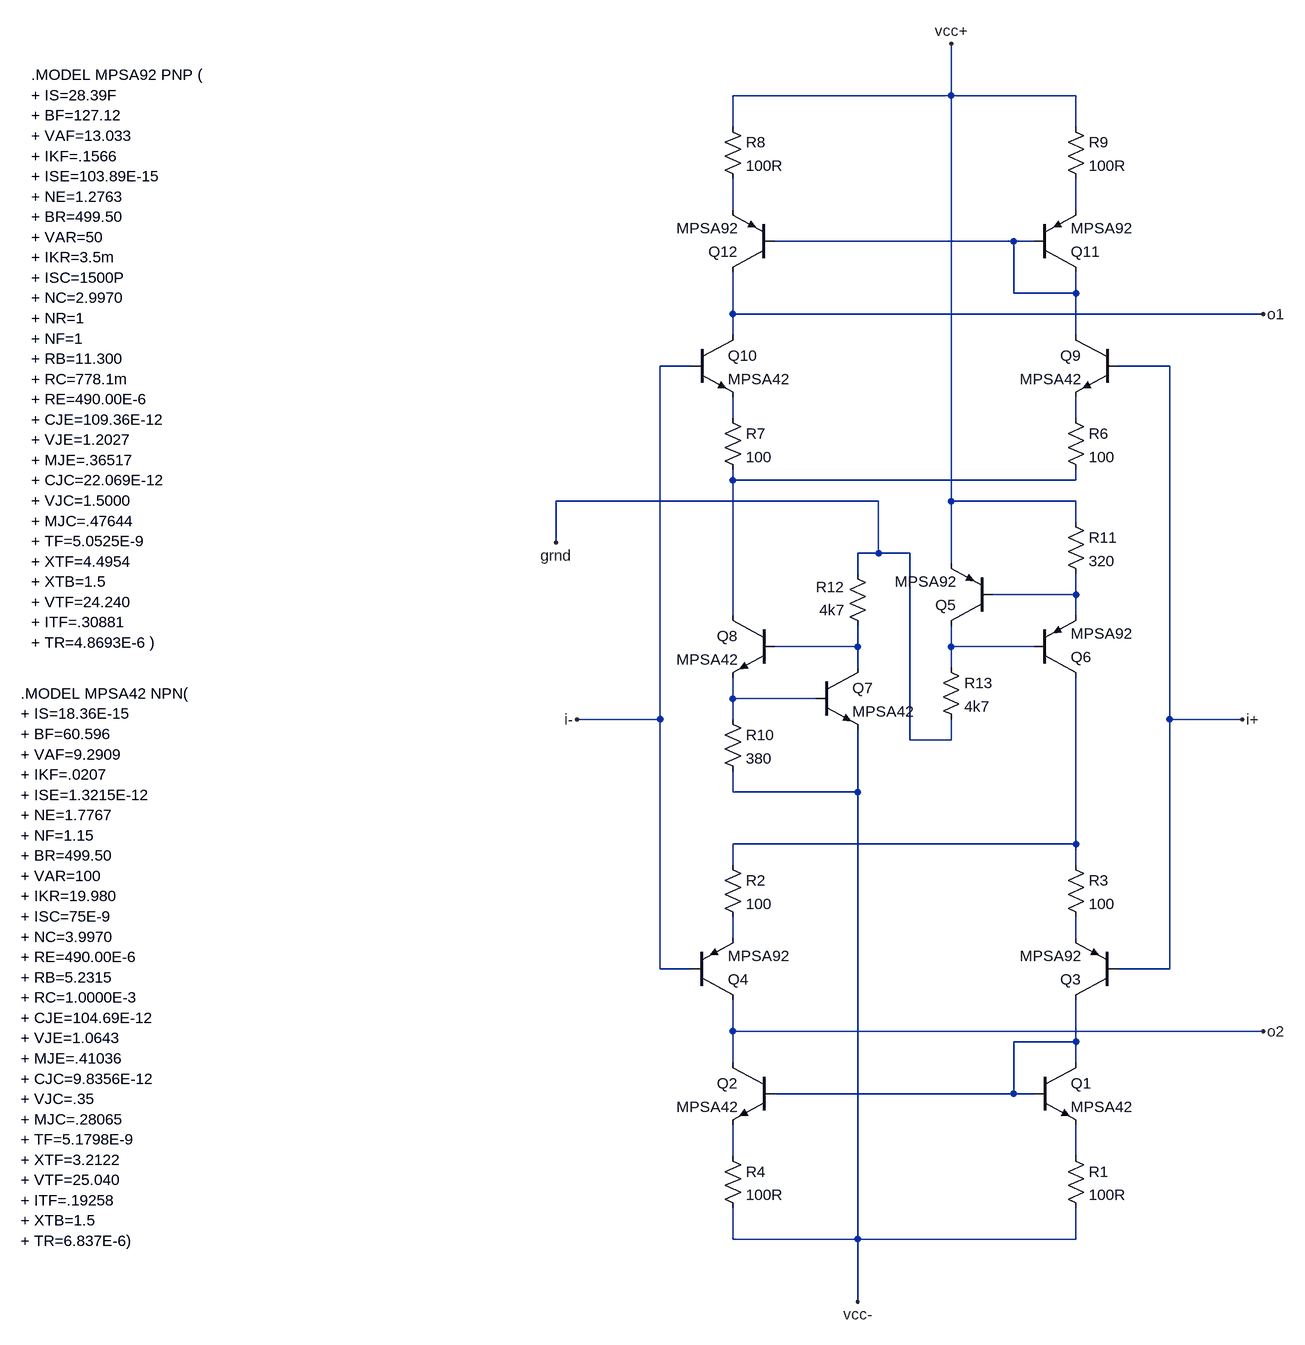
[diagram p0: schematic doble-par.asc]
doble-par.asc, the LTspice schematic file:
Version 4
SHEET 1 1184 756
WIRE 656 -1200 656 -1280
WIRE 656 -1200 320 -1200
WIRE 848 -1200 656 -1200
WIRE 320 -1152 320 -1200
WIRE 848 -1152 848 -1200
WIRE 320 -1024 320 -1072
WIRE 848 -1024 848 -1072
WIRE 752 -976 384 -976
WIRE 784 -976 752 -976
WIRE 752 -896 752 -976
WIRE 848 -896 848 -928
WIRE 848 -896 752 -896
WIRE 320 -864 320 -928
WIRE 1136 -864 320 -864
WIRE 320 -832 320 -864
WIRE 848 -832 848 -896
WIRE 256 -784 208 -784
WIRE 992 -784 912 -784
WIRE 320 -704 320 -736
WIRE 848 -704 848 -736
WIRE 320 -608 320 -624
WIRE 848 -608 848 -624
WIRE 848 -608 320 -608
WIRE 544 -576 48 -576
WIRE 656 -576 656 -1200
WIRE 848 -576 656 -576
WIRE 848 -544 848 -576
WIRE 48 -512 48 -576
WIRE 544 -496 544 -576
WIRE 544 -496 512 -496
WIRE 592 -496 544 -496
WIRE 656 -480 656 -576
WIRE 512 -464 512 -496
WIRE 848 -432 848 -464
WIRE 848 -432 720 -432
WIRE 320 -400 320 -608
WIRE 848 -400 848 -432
WIRE 512 -352 512 -384
WIRE 512 -352 384 -352
WIRE 656 -352 656 -384
WIRE 784 -352 656 -352
WIRE 512 -320 512 -352
WIRE 656 -320 656 -352
WIRE 320 -272 320 -304
WIRE 448 -272 320 -272
WIRE 208 -240 208 -784
WIRE 208 -240 80 -240
WIRE 320 -240 320 -272
WIRE 992 -240 992 -784
WIRE 1104 -240 992 -240
WIRE 592 -208 592 -496
WIRE 656 -208 656 -240
WIRE 656 -208 592 -208
WIRE 320 -128 320 -160
WIRE 512 -128 512 -224
WIRE 512 -128 320 -128
WIRE 848 -48 848 -304
WIRE 848 -48 320 -48
WIRE 320 -16 320 -48
WIRE 848 -16 848 -48
WIRE 320 96 320 64
WIRE 848 96 848 64
WIRE 208 144 208 -240
WIRE 256 144 208 144
WIRE 992 144 992 -240
WIRE 992 144 912 144
WIRE 320 240 320 192
WIRE 1136 240 320 240
WIRE 848 256 848 192
WIRE 848 256 752 256
WIRE 320 288 320 240
WIRE 848 288 848 256
WIRE 752 336 752 256
WIRE 752 336 384 336
WIRE 784 336 752 336
WIRE 320 432 320 384
WIRE 848 432 848 384
WIRE 320 560 320 512
WIRE 512 560 512 -128
WIRE 512 560 320 560
WIRE 848 560 848 512
WIRE 848 560 512 560
WIRE 512 656 512 560
FLAG 80 -240 i-
FLAG 1104 -240 i+
FLAG 1136 -864 o1
FLAG 656 -1280 vcc+
FLAG 512 656 vcc-
FLAG 48 -512 grnd
FLAG 1136 240 o2
SYMBOL npn 784 288 R0
SYMATTR InstName Q1
SYMATTR Value MPSA42
SYMBOL npn 384 288 M0
SYMATTR InstName Q2
SYMATTR Value MPSA42
SYMBOL pnp 912 192 R180
SYMATTR InstName Q3
SYMATTR Value MPSA92
SYMBOL pnp 256 192 M180
SYMATTR InstName Q4
SYMATTR Value MPSA92
SYMBOL res 832 416 R0
SYMATTR InstName R1
SYMATTR Value 100R
SYMBOL res 304 -32 R0
SYMATTR InstName R2
SYMATTR Value 100
SYMBOL res 832 -32 R0
SYMATTR InstName R3
SYMATTR Value 100
SYMBOL res 304 416 R0
SYMATTR InstName R4
SYMATTR Value 100R
SYMBOL pnp 720 -384 R180
SYMATTR InstName Q5
SYMATTR Value MPSA92
SYMBOL pnp 784 -304 M180
SYMATTR InstName Q6
SYMATTR Value MPSA92
SYMBOL npn 448 -320 R0
SYMATTR InstName Q7
SYMATTR Value MPSA42
SYMBOL npn 384 -400 M0
SYMATTR InstName Q8
SYMATTR Value MPSA42
SYMBOL npn 912 -832 M0
SYMATTR InstName Q9
SYMATTR Value MPSA42
SYMBOL npn 256 -832 R0
SYMATTR InstName Q10
SYMATTR Value MPSA42
SYMBOL res 832 -720 R0
SYMATTR InstName R6
SYMATTR Value 100
SYMBOL res 304 -720 R0
SYMATTR InstName R7
SYMATTR Value 100
SYMBOL pnp 784 -928 M180
SYMATTR InstName Q11
SYMATTR Value MPSA92
SYMBOL pnp 384 -928 R180
SYMATTR InstName Q12
SYMATTR Value MPSA92
SYMBOL res 304 -1168 R0
SYMATTR InstName R8
SYMATTR Value 100R
SYMBOL res 832 -1168 R0
SYMATTR InstName R9
SYMATTR Value 100R
SYMBOL res 304 -256 R0
SYMATTR InstName R10
SYMATTR Value 380
SYMBOL res 832 -560 R0
SYMATTR InstName R11
SYMATTR Value 320
SYMBOL res 528 -368 R180
WINDOW 0 36 76 Left 2
WINDOW 3 36 40 Left 2
SYMATTR InstName R12
SYMATTR Value 4k7
SYMBOL res 640 -336 R0
SYMATTR InstName R13
SYMATTR Value 4k7
TEXT -760 -1232 Left 2 !.MODEL MPSA92 PNP (\n+ IS=28.39F\n+ BF=127.12\n+ VAF=13.033\n+ IKF=.1566\n+ ISE=103.89E-15\n+ NE=1.2763\n+ BR=499.50\n+ VAR=50\n+ IKR=3.5m\n+ ISC=1500P\n+ NC=2.9970\n+ NR=1\n+ NF=1\n+ RB=11.300\n+ RC=778.1m\n+ RE=490.00E-6\n+ CJE=109.36E-12\n+ VJE=1.2027\n+ MJE=.36517\n+ CJC=22.069E-12\n+ VJC=1.5000\n+ MJC=.47644\n+ TF=5.0525E-9\n+ XTF=4.4954\n+ XTB=1.5\n+ VTF=24.240\n+ ITF=.30881\n+ TR=4.8693E-6 )
TEXT -776 -280 Left 2 !.MODEL MPSA42 NPN(\n+ IS=18.36E-15\n+ BF=60.596\n+ VAF=9.2909\n+ IKF=.0207\n+ ISE=1.3215E-12\n+ NE=1.7767\n+ NF=1.15\n+ BR=499.50\n+ VAR=100\n+ IKR=19.980\n+ ISC=75E-9\n+ NC=3.9970\n+ RE=490.00E-6\n+ RB=5.2315\n+ RC=1.0000E-3\n+ CJE=104.69E-12\n+ VJE=1.0643\n+ MJE=.41036\n+ CJC=9.8356E-12\n+ VJC=.35\n+ MJC=.28065\n+ TF=5.1798E-9\n+ XTF=3.2122\n+ VTF=25.040\n+ ITF=.19258\n+ XTB=1.5\n+ TR=6.837E-6)

The netlist it stands for:
* doble-par.asc
Q1 N014 N014 N016 0 MPSA42
Q2 o2 N014 N015 0 MPSA42
Q3 N014 i+ N013 0 MPSA92
Q4 o2 i- N012 0 MPSA92
R1 N016 vcc- 100R
R2 N011 N012 100
R3 N011 N013 100
R4 N015 vcc- 100R
Q5 N009 N007 vcc+ 0 MPSA92
Q6 N011 N009 N007 0 MPSA92
Q7 N008 N010 vcc- 0 MPSA42
Q8 N006 N008 N010 0 MPSA42
Q9 N003 i+ N005 0 MPSA42
Q10 o1 i- N004 0 MPSA42
R6 N005 N006 100
R7 N004 N006 100
Q11 N003 N003 N002 0 MPSA92
Q12 o1 N003 N001 0 MPSA92
R8 vcc+ N001 100R
R9 vcc+ N002 100R
R10 N010 vcc- 380
R11 vcc+ N007 320
R12 N008 grnd 4k7
R13 N009 grnd 4k7
.model NPN NPN
.model PNP PNP
.lib standard.bjt
.MODEL MPSA92 PNP (
+ IS=28.39F
+ BF=127.12
+ VAF=13.033
+ IKF=.1566
+ ISE=103.89E-15
+ NE=1.2763
+ BR=499.50
+ VAR=50
+ IKR=3.5m
+ ISC=1500P
+ NC=2.9970
+ NR=1
+ NF=1
+ RB=11.300
+ RC=778.1m
+ RE=490.00E-6
+ CJE=109.36E-12
+ VJE=1.2027
+ MJE=.36517
+ CJC=22.069E-12
+ VJC=1.5000
+ MJC=.47644
+ TF=5.0525E-9
+ XTF=4.4954
+ XTB=1.5
+ VTF=24.240
+ ITF=.30881
+ TR=4.8693E-6 )
.MODEL MPSA42 NPN(
+ IS=18.36E-15
+ BF=60.596
+ VAF=9.2909
+ IKF=.0207
+ ISE=1.3215E-12
+ NE=1.7767
+ NF=1.15
+ BR=499.50
+ VAR=100
+ IKR=19.980
+ ISC=75E-9
+ NC=3.9970
+ RE=490.00E-6
+ RB=5.2315
+ RC=1.0000E-3
+ CJE=104.69E-12
+ VJE=1.0643
+ MJE=.41036
+ CJC=9.8356E-12
+ VJC=.35
+ MJC=.28065
+ TF=5.1798E-9
+ XTF=3.2122
+ VTF=25.040
+ ITF=.19258
+ XTB=1.5
+ TR=6.837E-6)
.backanno
.end